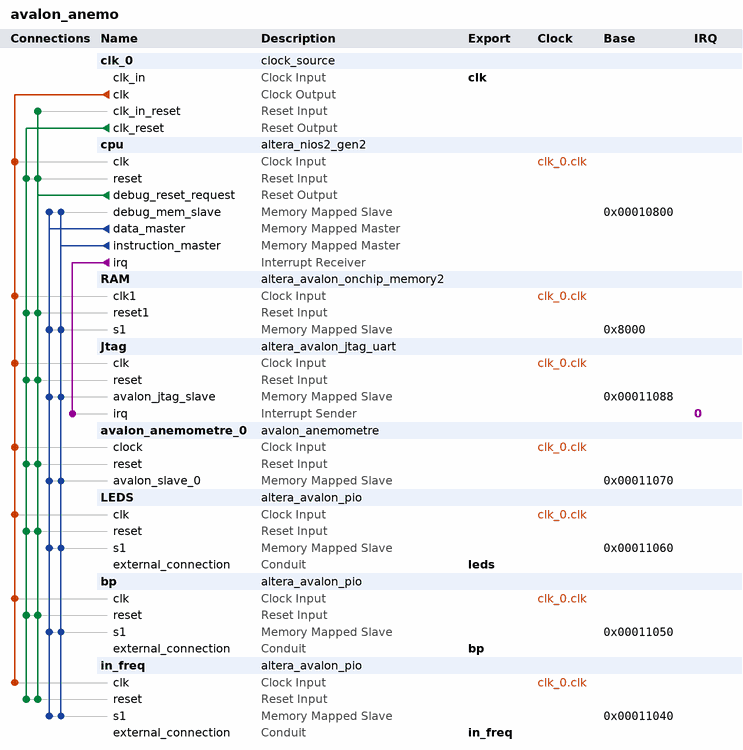
[diagram p0: system contents]
# Platform Designer (Qsys) system avalon_anemo, Cyclone IV E EP4CE22F17C6
# Parameters at their usual value, and those the tool derives, are not listed.
package require -exact qsys 18.1
create_system avalon_anemo
set_project_property DEVICE_FAMILY {Cyclone IV E}
set_project_property DEVICE EP4CE22F17C6

add_instance clk_0 clock_source 18.1
set_instance_parameter_value clk_0 clockFrequency 50000000

add_instance cpu altera_nios2_gen2 18.1
set_instance_parameter_value cpu dcache_size 2048
set_instance_parameter_value cpu exceptionSlave RAM.s1
set_instance_parameter_value cpu icache_size 4096
set_instance_parameter_value cpu impl Tiny
set_instance_parameter_value cpu resetSlave RAM.s1

add_instance RAM altera_avalon_onchip_memory2 18.1
set_instance_parameter_value RAM dataWidth 32
set_instance_parameter_value RAM dualPort false
set_instance_parameter_value RAM initMemContent true
set_instance_parameter_value RAM initializationFileName onchip_mem.hex
set_instance_parameter_value RAM memorySize 20000

add_instance Jtag altera_avalon_jtag_uart 18.1
set_instance_parameter_value Jtag simInteractiveOptions NO_INTERACTIVE_WINDOWS

add_instance avalon_anemometre_0 avalon_anemometre 1.0

add_instance LEDS altera_avalon_pio 18.1
set_instance_parameter_value LEDS direction Output
set_instance_parameter_value LEDS width 8

add_instance bp altera_avalon_pio 18.1
set_instance_parameter_value bp direction Input
set_instance_parameter_value bp width 2

add_instance in_freq altera_avalon_pio 18.1
set_instance_parameter_value in_freq direction Input
set_instance_parameter_value in_freq width 1

# connections
add_connection clk_0.clk avalon_anemometre_0.clock clock
add_connection clk_0.clk bp.clk clock
add_connection clk_0.clk cpu.clk clock
add_connection clk_0.clk in_freq.clk clock
add_connection clk_0.clk Jtag.clk clock
add_connection clk_0.clk LEDS.clk clock
add_connection clk_0.clk RAM.clk1 clock
add_connection clk_0.clk_reset avalon_anemometre_0.reset reset
add_connection clk_0.clk_reset bp.reset reset
add_connection clk_0.clk_reset cpu.reset reset
add_connection clk_0.clk_reset in_freq.reset reset
add_connection clk_0.clk_reset Jtag.reset reset
add_connection clk_0.clk_reset LEDS.reset reset
add_connection clk_0.clk_reset RAM.reset1 reset
add_connection cpu.debug_reset_request avalon_anemometre_0.reset reset
add_connection cpu.debug_reset_request bp.reset reset
add_connection cpu.debug_reset_request clk_0.clk_in_reset reset
add_connection cpu.debug_reset_request cpu.reset reset
add_connection cpu.debug_reset_request in_freq.reset reset
add_connection cpu.debug_reset_request Jtag.reset reset
add_connection cpu.debug_reset_request LEDS.reset reset
add_connection cpu.debug_reset_request RAM.reset1 reset
add_connection cpu.data_master avalon_anemometre_0.avalon_slave_0 avalon
set_connection_parameter_value cpu.data_master/avalon_anemometre_0.avalon_slave_0 baseAddress 0x00011070
add_connection cpu.data_master bp.s1 avalon
set_connection_parameter_value cpu.data_master/bp.s1 baseAddress 0x00011050
add_connection cpu.data_master cpu.debug_mem_slave avalon
set_connection_parameter_value cpu.data_master/cpu.debug_mem_slave baseAddress 0x00010800
add_connection cpu.data_master in_freq.s1 avalon
set_connection_parameter_value cpu.data_master/in_freq.s1 baseAddress 0x00011040
add_connection cpu.data_master Jtag.avalon_jtag_slave avalon
set_connection_parameter_value cpu.data_master/Jtag.avalon_jtag_slave baseAddress 0x00011088
add_connection cpu.data_master LEDS.s1 avalon
set_connection_parameter_value cpu.data_master/LEDS.s1 baseAddress 0x00011060
add_connection cpu.data_master RAM.s1 avalon
set_connection_parameter_value cpu.data_master/RAM.s1 baseAddress 0x8000
add_connection cpu.instruction_master avalon_anemometre_0.avalon_slave_0 avalon
set_connection_parameter_value cpu.instruction_master/avalon_anemometre_0.avalon_slave_0 baseAddress 0x00011070
add_connection cpu.instruction_master bp.s1 avalon
set_connection_parameter_value cpu.instruction_master/bp.s1 baseAddress 0x00011050
add_connection cpu.instruction_master cpu.debug_mem_slave avalon
set_connection_parameter_value cpu.instruction_master/cpu.debug_mem_slave baseAddress 0x00010800
add_connection cpu.instruction_master in_freq.s1 avalon
set_connection_parameter_value cpu.instruction_master/in_freq.s1 baseAddress 0x00011040
add_connection cpu.instruction_master Jtag.avalon_jtag_slave avalon
set_connection_parameter_value cpu.instruction_master/Jtag.avalon_jtag_slave baseAddress 0x00011088
add_connection cpu.instruction_master LEDS.s1 avalon
set_connection_parameter_value cpu.instruction_master/LEDS.s1 baseAddress 0x00011060
add_connection cpu.instruction_master RAM.s1 avalon
set_connection_parameter_value cpu.instruction_master/RAM.s1 baseAddress 0x8000
add_connection cpu.irq Jtag.irq interrupt
set_connection_parameter_value cpu.irq/Jtag.irq irqNumber 0

# exported interfaces
add_interface bp conduit end
set_interface_property bp EXPORT_OF bp.external_connection
add_interface clk clock sink
set_interface_property clk EXPORT_OF clk_0.clk_in
add_interface in_freq conduit end
set_interface_property in_freq EXPORT_OF in_freq.external_connection
add_interface leds conduit end
set_interface_property leds EXPORT_OF LEDS.external_connection

set_interconnect_requirement {$system} qsys_mm.clockCrossingAdapter HANDSHAKE
set_interconnect_requirement {$system} qsys_mm.enableEccProtection FALSE
set_interconnect_requirement {$system} qsys_mm.insertDefaultSlave FALSE
set_interconnect_requirement {$system} qsys_mm.maxAdditionalLatency 1

save_system avalon_anemo.qsys
